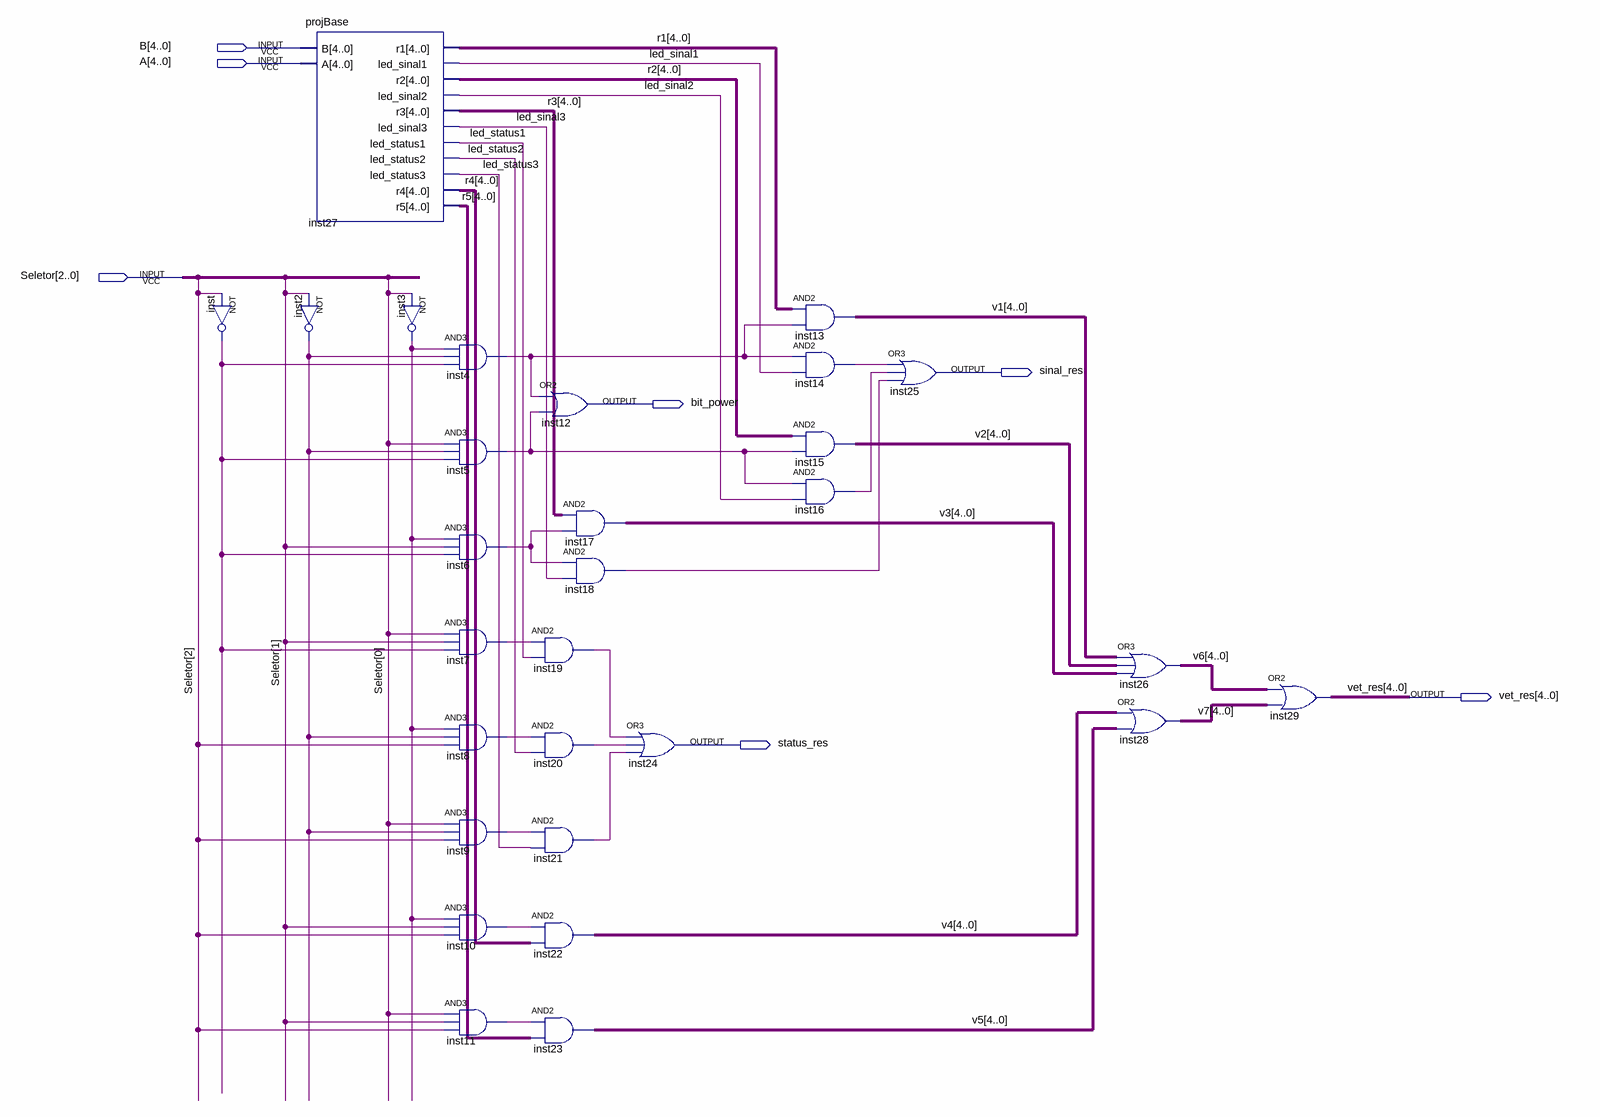
[diagram p0: schematic sheet]
// Quartus schematic projBase2.bdf as structural Verilog: 29 symbols, 7 pins
module projBase2 (
  input  [4:0] B,
  input  [4:0] A,
  input  [2:0] Seletor,
  output sinal_res,
  output bit_power,
  output [4:0] vet_res,
  output status_res
);

  wire inst2_out, inst3_out, inst4_out, inst5_out, inst6_out, inst7_out, inst8_out, inst9_out, inst10_out,
       inst11_out, inst14_out, inst16_out, inst18_out, inst19_out, inst20_out, inst21_out, inst_out,
       led_sinal1, led_sinal2, led_sinal3, led_status1, led_status2, led_status3;
  wire [4:0] r1, r2, r3, r4, r5, v1, v2, v3, v4, v5, v6, v7;

  not inst (inst_out, Seletor[2]);
  projBase inst27 (
    .B(B), .A(A), .r1(r1), .led_sinal1(led_sinal1), .r2(r2), .led_sinal2(led_sinal2), .r3(r3),
    .led_sinal3(led_sinal3), .led_status1(led_status1), .led_status2(led_status2), .led_status3(led_status3),
    .r4(r4), .r5(r5));
  not inst2 (inst2_out, Seletor[1]);
  not inst3 (inst3_out, Seletor[0]);
  and inst4 (inst4_out, inst3_out, inst2_out, inst_out);
  and inst5 (inst5_out, Seletor[0], inst2_out, inst_out);
  and inst6 (inst6_out, inst3_out, Seletor[1], inst_out);
  and inst7 (inst7_out, Seletor[0], Seletor[1], inst_out);
  and inst8 (inst8_out, inst3_out, inst2_out, Seletor[2]);
  and inst9 (inst9_out, Seletor[0], inst2_out, Seletor[2]);
  and inst10 (inst10_out, inst3_out, Seletor[1], Seletor[2]);
  and inst11 (inst11_out, Seletor[0], Seletor[1], Seletor[2]);
  or inst12 (bit_power, inst4_out, inst5_out);
  assign v3 = r3 & {5{inst6_out}};  // AND2 inst17, 5 bits wide
  and inst18 (inst18_out, inst6_out, led_sinal3);
  and inst19 (inst19_out, inst7_out, led_status1);
  and inst20 (inst20_out, inst8_out, led_status2);
  and inst21 (inst21_out, inst9_out, led_status3);
  assign v4 = {5{inst10_out}} & r4;  // AND2 inst22, 5 bits wide
  assign v5 = {5{inst11_out}} & r5;  // AND2 inst23, 5 bits wide
  or inst24 (status_res, inst19_out, inst20_out, inst21_out);
  assign v1 = r1 & {5{inst4_out}};  // AND2 inst13, 5 bits wide
  and inst14 (inst14_out, inst4_out, led_sinal1);
  assign v2 = r2 & {5{inst5_out}};  // AND2 inst15, 5 bits wide
  and inst16 (inst16_out, inst5_out, led_sinal2);
  or inst25 (sinal_res, inst14_out, inst16_out, inst18_out);
  assign v6 = v1 | v2 | v3;  // OR3 inst26, 5 bits wide
  assign v7 = v4 | v5;  // OR2 inst28, 5 bits wide
  assign vet_res = v6 | v7;  // OR2 inst29, 5 bits wide
endmodule
